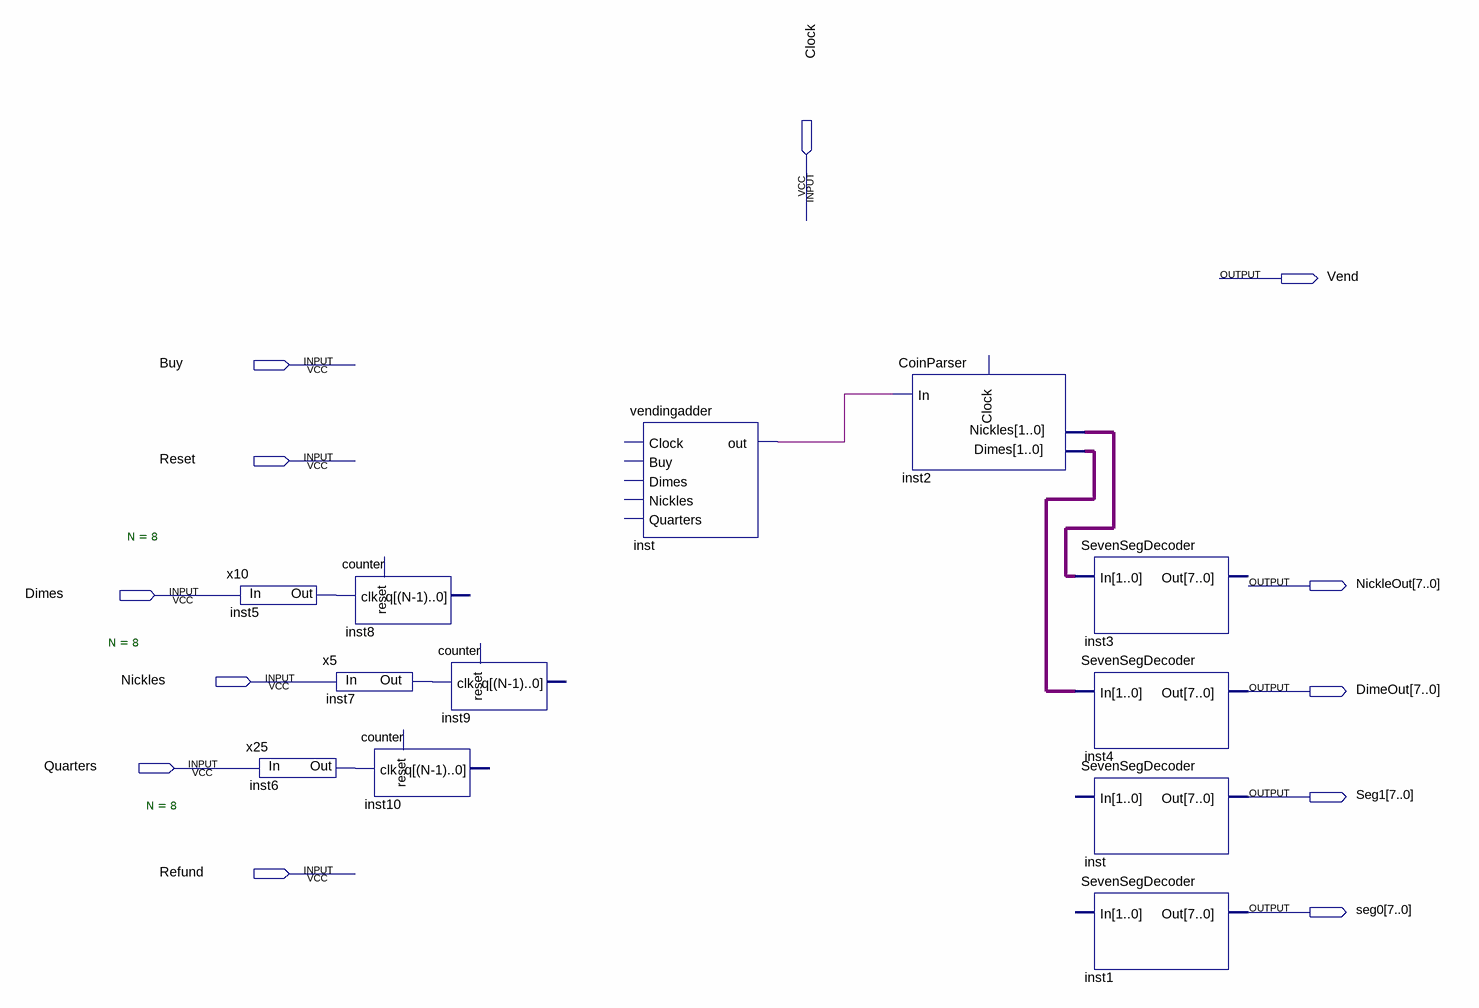
[diagram p0: schematic sheet]
// Quartus schematic vendingMachineProject.bdf as structural Verilog: 12 symbols, 12 pins
module vendingMachineProject (
  input  Clock,
  input  Buy,
  input  Reset,
  input  Dimes,
  input  Nickles,
  input  Quarters,
  input  Refund,
  output Vend,
  output [7:0] NickleOut,
  output [7:0] DimeOut,
  output [7:0] Seg1,
  output [7:0] seg0
);

  wire inst5_out, inst6_out, inst7_out, inst_out;
  wire [1:0] inst2_dimes, inst2_nickles;

  x10 inst5 (.In(Dimes), .Out(inst5_out));
  x25 inst6 (.In(Quarters), .Out(inst6_out));
  counter #(.N(8)) inst8 (.clk(inst5_out));  // open: reset, q
  x5 inst7 (.In(Nickles), .Out(inst7_out));
  counter #(.N(8)) inst10 (.clk(inst6_out));  // open: reset, q
  counter #(.N(8)) inst9 (.clk(inst7_out));  // open: reset, q
  vendingadder inst (.out(inst_out));  // open: Clock, Buy, Dimes, Nickles, Quarters
  CoinParser inst2 (.In(inst_out), .Nickles(inst2_nickles), .Dimes(inst2_dimes));  // open: Clock
  SevenSegDecoder inst3 (.In(inst2_nickles));  // open: Out
  SevenSegDecoder inst4 (.In(inst2_dimes), .Out(DimeOut));
  SevenSegDecoder inst_dup2 (.Out(Seg1));  // open: In
  SevenSegDecoder inst1 (.Out(seg0));  // open: In
endmodule
